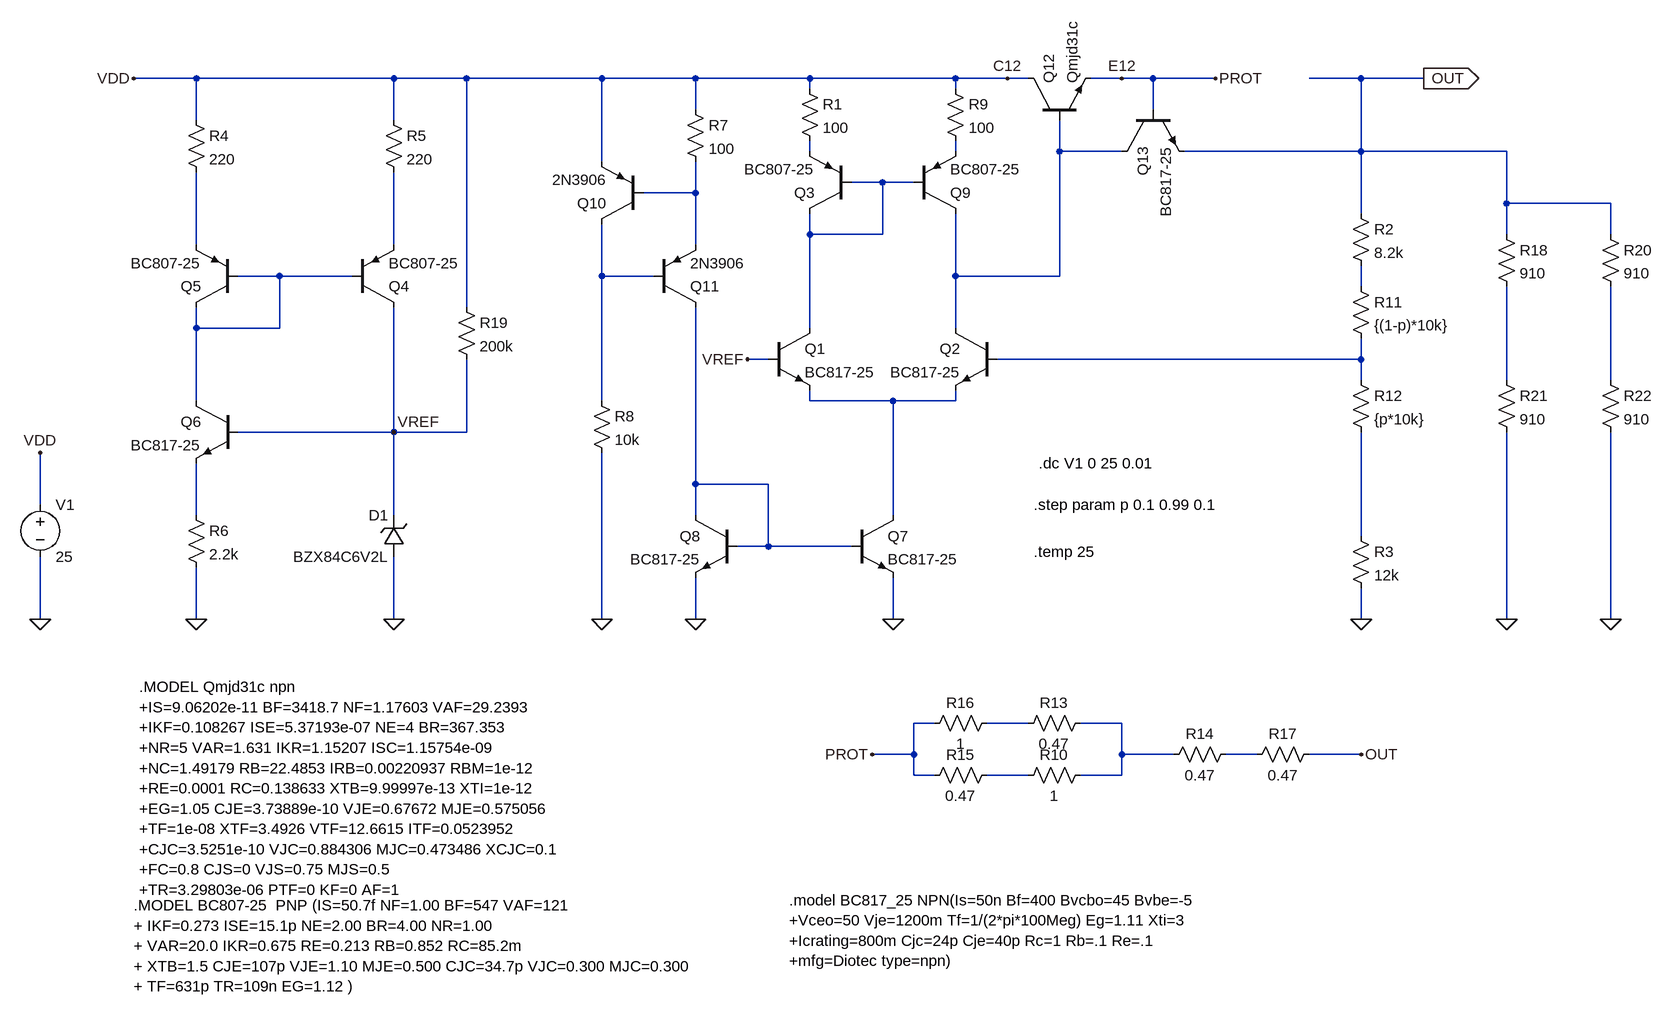
[diagram p0: schematic LDO_OP.asc]
LDO_OP.asc, the LTspice schematic file:
Version 4
SHEET 1 5060 1420
WIRE -1168 0 -1264 0
WIRE -864 0 -1168 0
WIRE -752 0 -864 0
WIRE -544 0 -752 0
WIRE -400 0 -544 0
WIRE -224 0 -400 0
WIRE 0 0 -224 0
WIRE 80 0 0 0
WIRE 112 0 80 0
WIRE 256 0 208 0
WIRE 304 0 256 0
WIRE 400 0 304 0
WIRE 624 0 544 0
WIRE 720 0 624 0
WIRE -224 16 -224 0
WIRE 0 16 0 0
WIRE -400 48 -400 0
WIRE 304 48 304 0
WIRE -1168 64 -1168 0
WIRE -864 64 -864 0
WIRE -224 112 -224 96
WIRE 0 112 0 96
WIRE 160 112 160 64
WIRE 256 112 160 112
WIRE 624 112 624 0
WIRE 624 112 352 112
WIRE 848 112 624 112
WIRE -544 128 -544 0
WIRE -112 160 -160 160
WIRE -64 160 -112 160
WIRE -400 176 -400 128
WIRE -400 176 -480 176
WIRE 848 192 848 112
WIRE 1008 192 848 192
WIRE 624 208 624 112
WIRE -224 240 -224 208
WIRE -112 240 -112 160
WIRE -112 240 -224 240
WIRE 848 240 848 192
WIRE 1008 240 1008 192
WIRE -1168 256 -1168 144
WIRE -864 256 -864 144
WIRE -400 256 -400 176
WIRE -1040 304 -1104 304
WIRE -928 304 -1040 304
WIRE -544 304 -544 224
WIRE -464 304 -544 304
WIRE 0 304 0 208
WIRE 160 304 160 112
WIRE 160 304 0 304
WIRE 624 320 624 288
WIRE -752 352 -752 0
WIRE -1168 384 -1168 352
WIRE -1040 384 -1040 304
WIRE -1040 384 -1168 384
WIRE -224 384 -224 240
WIRE 0 384 0 304
WIRE -288 432 -320 432
WIRE 624 432 624 400
WIRE 624 432 64 432
WIRE 624 464 624 432
WIRE 848 464 848 320
WIRE 1008 464 1008 320
WIRE -1168 496 -1168 384
WIRE -544 496 -544 304
WIRE -224 496 -224 480
WIRE -96 496 -224 496
WIRE 0 496 0 480
WIRE 0 496 -96 496
WIRE -864 544 -864 352
WIRE -864 544 -1104 544
WIRE -752 544 -752 432
WIRE -752 544 -864 544
WIRE -400 624 -400 352
WIRE -288 624 -400 624
WIRE -1408 656 -1408 576
WIRE -1168 672 -1168 592
WIRE -864 672 -864 544
WIRE -400 672 -400 624
WIRE -96 672 -96 496
WIRE 624 704 624 544
WIRE -288 720 -288 624
WIRE -288 720 -336 720
WIRE -160 720 -288 720
WIRE -1408 832 -1408 736
WIRE -1168 832 -1168 752
WIRE -864 832 -864 736
WIRE -544 832 -544 576
WIRE -400 832 -400 768
WIRE -96 832 -96 768
WIRE 624 832 624 784
WIRE 848 832 848 544
WIRE 1008 832 1008 544
WIRE -32 992 -64 992
WIRE 112 992 48 992
WIRE 256 992 192 992
WIRE -64 1040 -64 992
WIRE -64 1040 -128 1040
WIRE 256 1040 256 992
WIRE 336 1040 256 1040
WIRE 464 1040 416 1040
WIRE 624 1040 544 1040
WIRE -64 1072 -64 1040
WIRE -32 1072 -64 1072
WIRE 112 1072 48 1072
WIRE 256 1072 256 1040
WIRE 256 1072 192 1072
FLAG 624 832 0
FLAG -1168 832 0
FLAG -96 832 0
FLAG -400 832 0
FLAG -544 832 0
FLAG -320 432 VREF
FLAG 720 0 OUT
IOPIN 720 0 Out
FLAG 80 0 C12
FLAG 256 0 E12
FLAG -1408 832 0
FLAG 400 0 PROT
FLAG -128 1040 PROT
FLAG 624 1040 OUT
FLAG -1408 576 VDD
FLAG -1264 0 VDD
FLAG -864 832 0
FLAG -864 544 VREF
FLAG 848 832 0
FLAG 1008 832 0
SYMBOL npn -288 384 R0
SYMATTR InstName Q1
SYMATTR Value BC817-25
SYMBOL npn 64 384 M0
SYMATTR InstName Q2
SYMATTR Value BC817-25
SYMBOL res 608 192 R0
SYMATTR InstName R2
SYMATTR Value 8.2k
SYMBOL res 608 688 R0
SYMATTR InstName R3
SYMATTR Value 12k
SYMBOL pnp -928 352 M180
SYMATTR InstName Q4
SYMATTR Value BC807-25
SYMBOL pnp -1104 352 R180
SYMATTR InstName Q5
SYMATTR Value BC807-25
SYMBOL npn -1104 496 M0
SYMATTR InstName Q6
SYMATTR Value BC817-25
SYMBOL res -1184 48 R0
SYMATTR InstName R4
SYMATTR Value 220
SYMBOL res -880 48 R0
SYMATTR InstName R5
SYMATTR Value 220
SYMBOL res -1184 656 R0
SYMATTR InstName R6
SYMATTR Value 2.2k
SYMBOL npn -160 672 R0
SYMATTR InstName Q7
SYMATTR Value BC817-25
SYMBOL npn -336 672 M0
SYMATTR InstName Q8
SYMATTR Value BC817-25
SYMBOL pnp -480 224 R180
SYMATTR InstName Q10
SYMATTR Value 2N3906
SYMBOL pnp -464 352 M180
SYMATTR InstName Q11
SYMATTR Value 2N3906
SYMBOL res -416 32 R0
SYMATTR InstName R7
SYMATTR Value 100
SYMBOL res -560 480 R0
SYMATTR InstName R8
SYMATTR Value 10k
SYMBOL pnp -160 208 R180
SYMATTR InstName Q3
SYMATTR Value BC807-25
SYMBOL pnp -64 208 M180
SYMATTR InstName Q9
SYMATTR Value BC807-25
SYMBOL npn 112 64 R270
SYMATTR InstName Q12
SYMATTR Value Qmjd31c
SYMBOL res -240 0 R0
SYMATTR InstName R1
SYMATTR Value 100
SYMBOL res -16 0 R0
SYMATTR InstName R9
SYMATTR Value 100
SYMBOL npn 256 48 M90
SYMATTR InstName Q13
SYMATTR Value BC817-25
SYMBOL res 608 304 R0
SYMATTR InstName R11
SYMATTR Value {(1-p)*10k}
SYMBOL res 608 448 R0
SYMATTR InstName R12
SYMATTR Value {p*10k}
SYMBOL res 208 1056 R90
WINDOW 0 0 56 VBottom 2
WINDOW 3 32 56 VTop 2
SYMATTR InstName R10
SYMATTR Value 1
SYMBOL res 208 976 R90
WINDOW 0 0 56 VBottom 2
WINDOW 3 32 56 VTop 2
SYMATTR InstName R13
SYMATTR Value 0.47
SYMBOL res 432 1024 R90
WINDOW 0 0 56 VBottom 2
WINDOW 3 32 56 VTop 2
SYMATTR InstName R14
SYMATTR Value 0.47
SYMBOL res 64 1056 R90
WINDOW 0 0 56 VBottom 2
WINDOW 3 32 56 VTop 2
SYMATTR InstName R15
SYMATTR Value 0.47
SYMBOL res 64 976 R90
WINDOW 0 0 56 VBottom 2
WINDOW 3 32 56 VTop 2
SYMATTR InstName R16
SYMATTR Value 1
SYMBOL res 560 1024 R90
WINDOW 0 0 56 VBottom 2
WINDOW 3 32 56 VTop 2
SYMATTR InstName R17
SYMATTR Value 0.47
SYMBOL zener -848 736 R180
WINDOW 0 24 64 Left 2
WINDOW 3 24 0 Left 2
SYMATTR InstName D1
SYMATTR Value BZX84C6V2L
SYMBOL voltage -1408 640 R0
WINDOW 123 0 0 Left 0
WINDOW 39 0 0 Left 0
SYMATTR InstName V1
SYMATTR Value 25
SYMBOL res 832 224 R0
SYMATTR InstName R18
SYMATTR Value 910
SYMBOL res 992 224 R0
SYMATTR InstName R20
SYMATTR Value 910
SYMBOL res 832 448 R0
SYMATTR InstName R21
SYMATTR Value 910
SYMBOL res 992 448 R0
SYMATTR InstName R22
SYMATTR Value 910
SYMBOL res -768 336 R0
SYMATTR InstName R19
SYMATTR Value 200k
TEXT 120 656 Left 2 !.step param p 0.1 0.99 0.1
TEXT -256 1264 Left 2 !.model BC817_25 NPN(Is=50n Bf=400 Bvcbo=45 Bvbe=-5\n+Vceo=50 Vje=1200m Tf=1/(2*pi*100Meg) Eg=1.11 Xti=3\n+Icrating=800m Cjc=24p Cje=40p Rc=1 Rb=.1 Re=.1\n+mfg=Diotec type=npn)
TEXT -1256 936 Left 2 !.MODEL Qmjd31c npn\n+IS=9.06202e-11 BF=3418.7 NF=1.17603 VAF=29.2393\n+IKF=0.108267 ISE=5.37193e-07 NE=4 BR=367.353\n+NR=5 VAR=1.631 IKR=1.15207 ISC=1.15754e-09\n+NC=1.49179 RB=22.4853 IRB=0.00220937 RBM=1e-12\n+RE=0.0001 RC=0.138633 XTB=9.99997e-13 XTI=1e-12\n+EG=1.05 CJE=3.73889e-10 VJE=0.67672 MJE=0.575056\n+TF=1e-08 XTF=3.4926 VTF=12.6615 ITF=0.0523952\n+CJC=3.5251e-10 VJC=0.884306 MJC=0.473486 XCJC=0.1\n+FC=0.8 CJS=0 VJS=0.75 MJS=0.5\n+TR=3.29803e-06 PTF=0 KF=0 AF=1
TEXT 128 592 Left 2 !.dc V1 0 25 0.01
TEXT -1264 1272 Left 2 !.MODEL BC807-25  PNP (IS=50.7f NF=1.00 BF=547 VAF=121\n+ IKF=0.273 ISE=15.1p NE=2.00 BR=4.00 NR=1.00\n+ VAR=20.0 IKR=0.675 RE=0.213 RB=0.852 RC=85.2m\n+ XTB=1.5 CJE=107p VJE=1.10 MJE=0.500 CJC=34.7p VJC=0.300 MJC=0.300 \n+ TF=631p TR=109n EG=1.12 )
TEXT 120 728 Left 2 !.temp 25

The netlist it stands for:
* LDO_OP.asc
Q1 N004 VREF N014 0 BC817-25
Q2 N003 N011 N014 0 BC817-25
R2 OUT N010 8.2k
R3 N017 0 12k
Q4 VREF N008 N007 0 BC807-25
Q5 N008 N008 N006 0 BC807-25
Q6 N008 VREF N016 0 BC817-25
R4 VDD N006 220
R5 VDD N007 220
R6 N016 0 2.2k
Q7 N014 N015 0 0 BC817-25
Q8 N015 N015 0 0 BC817-25
Q10 N009 N005 VDD 0 2N3906
Q11 N015 N009 N005 0 2N3906
R7 VDD N005 100
R8 N009 0 10k
Q3 N004 N004 N001 0 BC807-25
Q9 N003 N004 N002 0 BC807-25
Q12 VDD N003 PROT 0 Qmjd31c
R1 VDD N001 100
R9 VDD N002 100
Q13 N003 PROT OUT 0 BC817-25
R11 N010 N011 {(1-p)*10k}
R12 N011 N017 {p*10k}
R10 N019 N021 1
R13 N019 N018 0.47
R14 N020 N019 0.47
R15 N021 PROT 0.47
R16 N018 PROT 1
R17 OUT N020 0.47
D1 0 VREF BZX84C6V2L
V1 VDD 0 25
R18 OUT N012 910
R20 OUT N013 910
R21 N012 0 910
R22 N013 0 910
R19 VDD VREF 200k
.model D D
.lib standard.dio
.model NPN NPN
.model PNP PNP
.lib standard.bjt
.step param p 0.1 0.99 0.1
.model BC817_25 NPN(Is=50n Bf=400 Bvcbo=45 Bvbe=-5
+Vceo=50 Vje=1200m Tf=1/(2*pi*100Meg) Eg=1.11 Xti=3
+Icrating=800m Cjc=24p Cje=40p Rc=1 Rb=.1 Re=.1
+mfg=Diotec type=npn)
.MODEL Qmjd31c npn
+IS=9.06202e-11 BF=3418.7 NF=1.17603 VAF=29.2393
+IKF=0.108267 ISE=5.37193e-07 NE=4 BR=367.353
+NR=5 VAR=1.631 IKR=1.15207 ISC=1.15754e-09
+NC=1.49179 RB=22.4853 IRB=0.00220937 RBM=1e-12
+RE=0.0001 RC=0.138633 XTB=9.99997e-13 XTI=1e-12
+EG=1.05 CJE=3.73889e-10 VJE=0.67672 MJE=0.575056
+TF=1e-08 XTF=3.4926 VTF=12.6615 ITF=0.0523952
+CJC=3.5251e-10 VJC=0.884306 MJC=0.473486 XCJC=0.1
+FC=0.8 CJS=0 VJS=0.75 MJS=0.5
+TR=3.29803e-06 PTF=0 KF=0 AF=1
.dc V1 0 25 0.01
.MODEL BC807-25  PNP (IS=50.7f NF=1.00 BF=547 VAF=121
+ IKF=0.273 ISE=15.1p NE=2.00 BR=4.00 NR=1.00
+ VAR=20.0 IKR=0.675 RE=0.213 RB=0.852 RC=85.2m
+ XTB=1.5 CJE=107p VJE=1.10 MJE=0.500 CJC=34.7p VJC=0.300 MJC=0.300
+ TF=631p TR=109n EG=1.12 )
.temp 25
.backanno
.end